# Altium schematic sheet [11]-EMMC Chip.SchDoc: RK3399 SOM Board Design V1.0
size A4; Author: AVIRAL MISHRA; DocumentNumber: 13; SheetNumber: 13; SheetTotal: 21; PROJECT CODE: A_V1.0
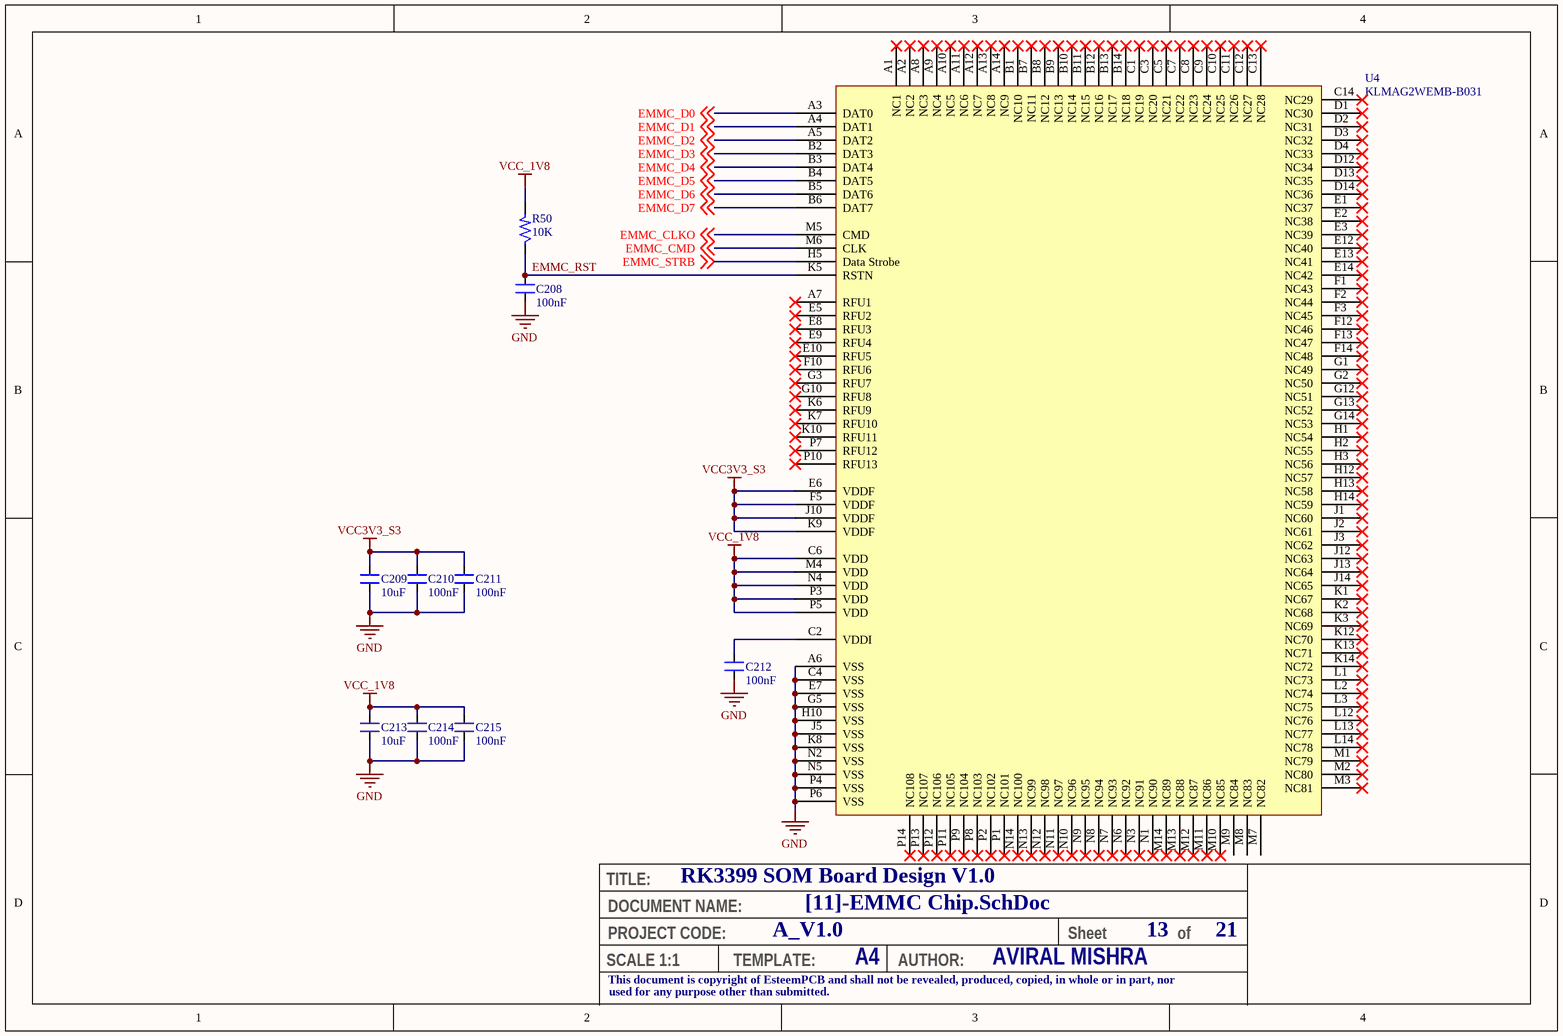
[diagram p0: [11]-EMMC Chip.SchDoc]

## Parts
C208  100nF  [CAP_0201]
C209  10uF  [CAP_0603]
C210  100nF  [CAP_0201]
C211  100nF  [CAP_0201]
C212  100nF  [CAP_0201]
C213  10uF  [CAP_0603]
C214  100nF  [CAP_0201]
C215  100nF  [CAP_0201]
R50  10K  [RES_0201]
U4  KLMAG2WEMB-B031  [BGA153C50P14X14_1150X1300X70]

## Nets
GND: C208.1 C209.1 C210.1 C211.1 C212.1 C213.1 C214.1 C215.1 U4.A6(VSS) U4.C4(VSS) U4.E7(VSS) U4.G5(VSS) U4.H10(VSS) U4.J5(VSS) U4.K8(VSS) U4.N2(VSS) U4.N5(VSS) U4.P4(VSS) U4.P6(VSS)
VCC3V3_S3: C209.2 C210.2 C211.2 U4.E6(VDDF) U4.F5(VDDF) U4.J10(VDDF) U4.K9(VDDF)
VCC_1V8: C213.2 C214.2 C215.2 R50.2 U4.C6(VDD) U4.M4(VDD) U4.N4(VDD) U4.P3(VDD) U4.P5(VDD)
EMMC_CLKO: U4.M5(CMD) ; off-sheet EMMC_CLKO
EMMC_CMD: U4.M6(CLK) ; off-sheet EMMC_CMD
EMMC_D0: U4.A3(DAT0) ; off-sheet EMMC_D0
EMMC_D1: U4.A4(DAT1) ; off-sheet EMMC_D1
EMMC_D2: U4.A5(DAT2) ; off-sheet EMMC_D2
EMMC_D3: U4.B2(DAT3) ; off-sheet EMMC_D3
EMMC_D4: U4.B3(DAT4) ; off-sheet EMMC_D4
EMMC_D5: U4.B4(DAT5) ; off-sheet EMMC_D5
EMMC_D6: U4.B5(DAT6) ; off-sheet EMMC_D6
EMMC_D7: U4.B6(DAT7) ; off-sheet EMMC_D7
EMMC_RST: C208.2 R50.1 U4.K5(RSTN)
EMMC_STRB: U4.H5(Data_Strobe) ; off-sheet EMMC_STRB
NetC212_2: C212.2 U4.C2(VDDI)

Not connected (* = marked no-connect by the designer): U4 A1(NC1)* A2(NC2)* A7(RFU1)* A8(NC3)* A9(NC4)* A10(NC5)* A11(NC6)* A12(NC7)* A13(NC8)* A14(NC9)* B1(NC10)* B7(NC11)* B8(NC12)* B9(NC13)* B10(NC14)* B11(NC15)* B12(NC16)* B13(NC17)* B14(NC18)* C1(NC19)* C3(NC20)* C5(NC21)* C7(NC22)* C8(NC23)* C9(NC24)* C10(NC25)* C11(NC26)* C12(NC27)* C13(NC28)* C14(NC29)* D1(NC30)* D2(NC31)* D3(NC32)* D4(NC33)* D12(NC34)* D13(NC35)* D14(NC36)* E1(NC37)* E2(NC38)* E3(NC39)* E5(RFU2)* E8(RFU3)* E9(RFU4)* E10(RFU5)* E12(NC40)* E13(NC41)* E14(NC42)* F1(NC43)* F2(NC44)* F3(NC45)* F10(RFU6)* F12(NC46)* F13(NC47)* F14(NC48)* G1(NC49)* G2(NC50)* G3(RFU7)* G10(RFU8)* G12(NC51)* G13(NC52)* G14(NC53)* H1(NC54)* H2(NC55)* H3(NC56)* H12(NC57)* H13(NC58)* H14(NC59)* J1(NC60)* J2(NC61)* J3(NC62)* J12(NC63)* J13(NC64)* J14(NC65)* K1(NC67)* K2(NC68)* K3(NC69)* K6(RFU9)* K7(RFU10)* K10(RFU11)* K12(NC70)* K13(NC71)* K14(NC72)* L1(NC73)* L2(NC74)* L3(NC75)* L12(NC76)* L13(NC77)* L14(NC78)* M1(NC79)* M2(NC80)* M3(NC81)* M7(NC82) M8(NC83) M9(NC84) M10(NC85)* M11(NC86)* M12(NC87)* M13(NC88)* M14(NC89)* N1(NC90)* N3(NC91)* N6(NC92)* N7(NC93)* N8(NC94)* N9(NC95)* N10(NC96)* N11(NC97)* N12(NC98)* N13(NC99)* N14(NC100)* P1(NC101)* P2(NC102)* P7(RFU12)* P8(NC103)* P9(NC104)* P10(RFU13)* P11(NC105)* P12(NC106)* P13(NC107)* P14(NC108)*

## Notes on the sheet
- TITLE:
- DOCUMENT NAME:
- SCALE 1:1
- This document is copyright of EsteemPCB and shall not be revealed, produced, copied, in whole or in part, nor
- PROJECT CODE:
- TEMPLATE:
- A4
- AUTHOR:
- Sheet
- of
- used for any purpose other than submitted.

## Library data of the parts
C208 C210-C212 C214 C215 = CAP_100nF-25V-10%-0201: 0.1µF ±10% 25V Ceramic Capacitor X5R 0201 (0603 Metric) /; Manufacturer: TDK Corporation; Manufacturer Part Number: C0603X5R1E104K030BB; Case/Package: 0201; Supplier-1: Digikey
C209 C213 = CAP_10uF-10V-10%-0603: 10µF ±10% 10V Ceramic Capacitor X5R 0603 (1608 Metric) /; Manufacturer Part Number: GRM188R61A106KE69J; Manufacturer: Murata Electronics; Case/Package: 0603; Supplier-1: Digikey
R50 = RES_10K-0.05W-1%-0201: 10 kOhms ±1% 0.05W, 1/20W Chip Resistor 0201 (0603 Metric) Thick Film /; Manufacturer: Stackpole Electronics Inc; Manufacturer Part Number: RMCF0201FT10K0; Case/Package: 0201; Supplier-1: Digikey
U4 = IC_KLMAG2WEMB-B031: 16GB NAND Flash Memory; Manufacturer: Samsung Electronics; Manufacturer Part Number: KLMAG2WEMB-B031; Case/Package: 153-FBGA; Supplier-1: NA